# Altium schematic sheet Display7Seg-4511-ULN2003.SCHDOC
size B
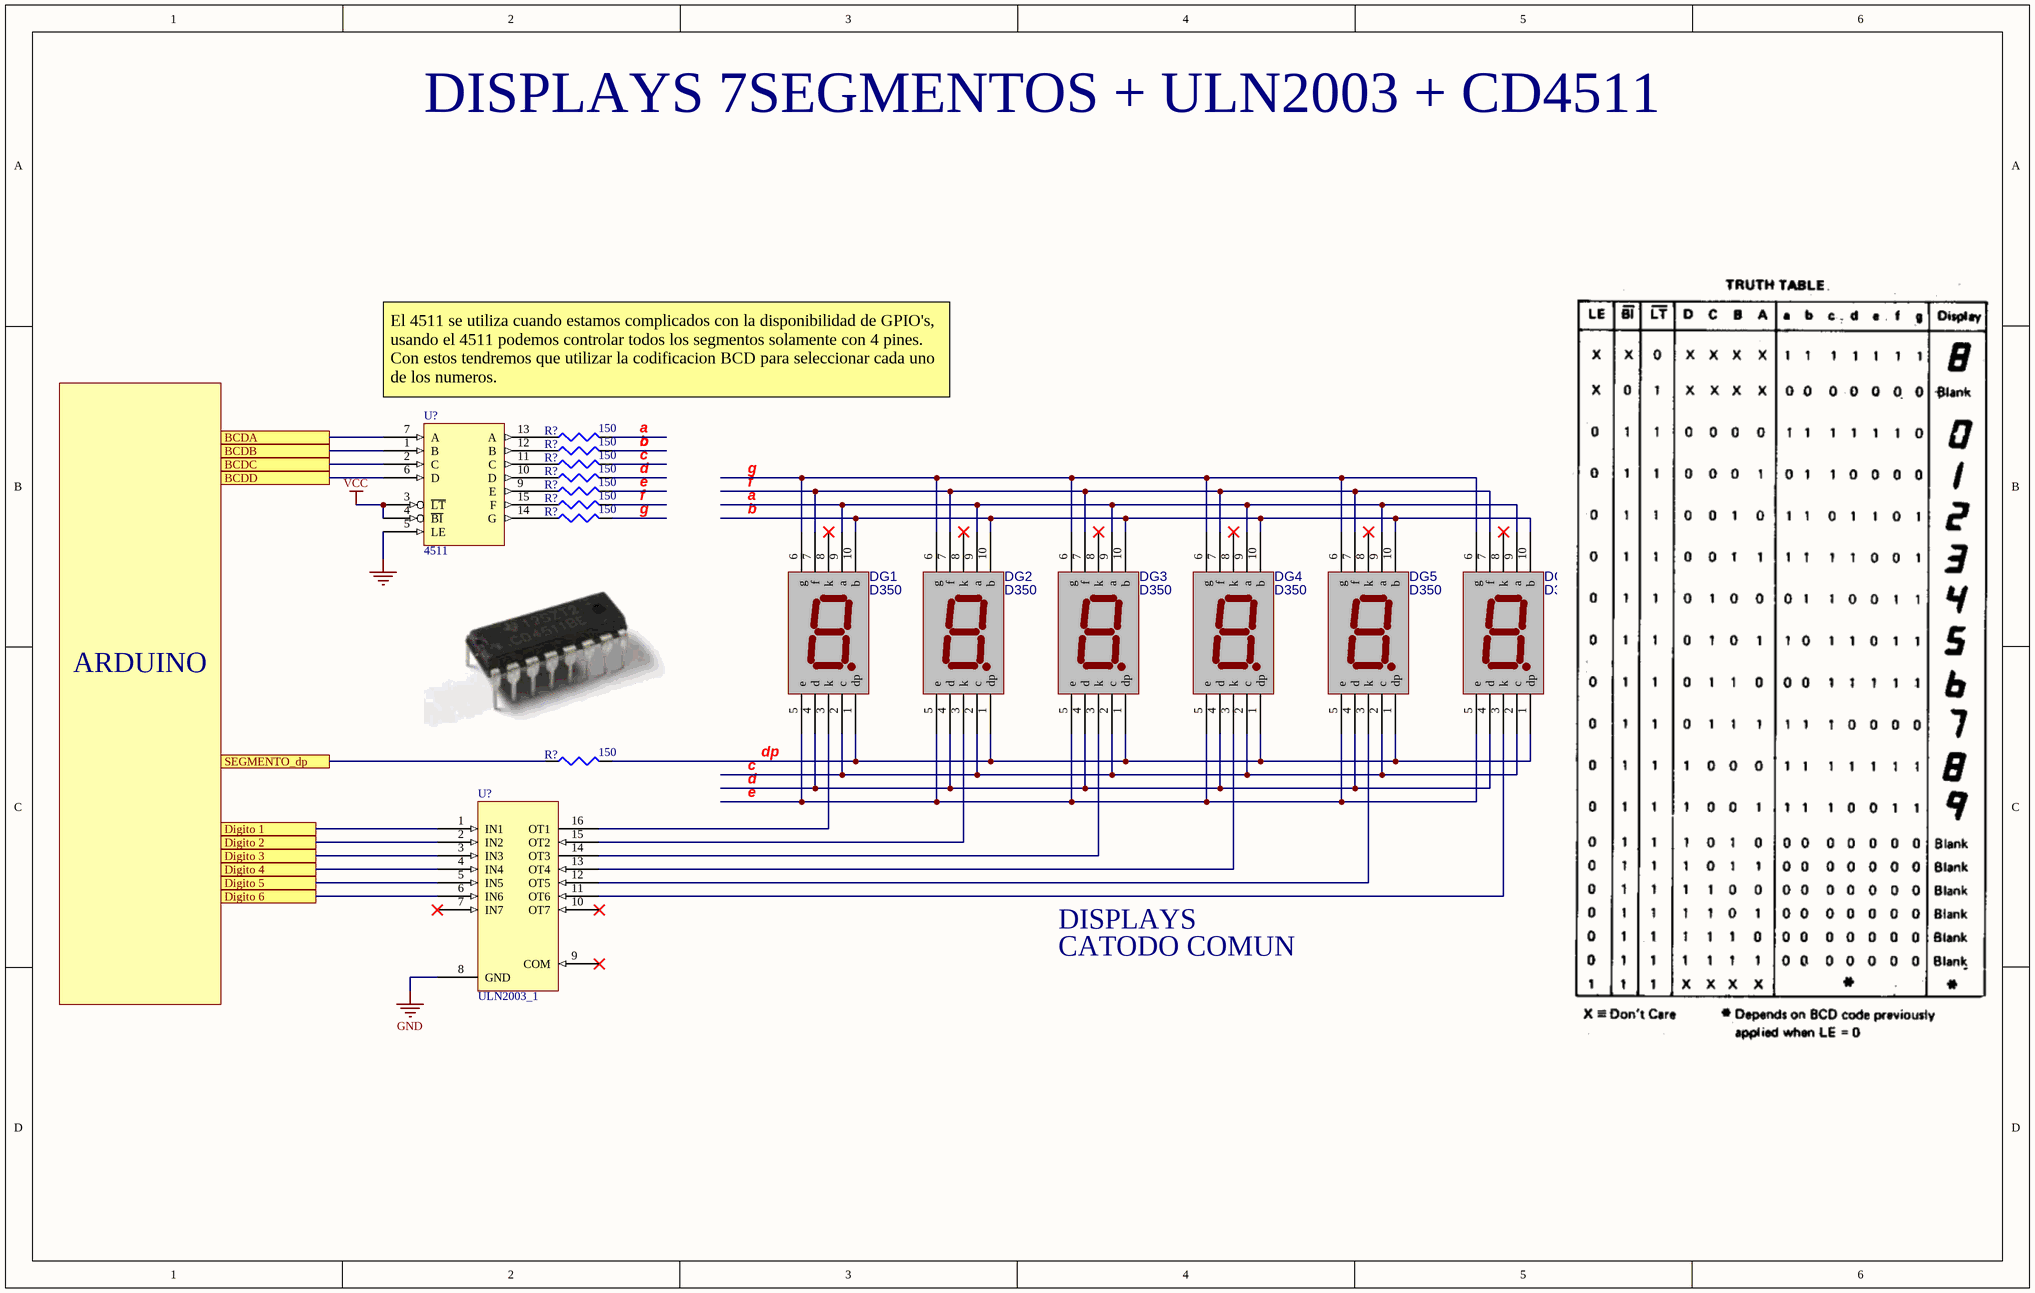
[diagram p0: Display7Seg-4511-ULN2003.SCHDOC]

## Parts
(Parts that share a designator on the sheet are numbered #1, #2 ... from top to bottom, then left to right.)
DG1  D350  [DIGIT0.7]
DG2  D350  [DIGIT0.7]
DG3  D350  [DIGIT0.7]
DG4  D350  [DIGIT0.7]
DG5  D350  [DIGIT0.7]
DG6  D350  [DIGIT0.7]
R?#1  150  [AXIAL0.3]
R?#2  150  [AXIAL0.3]
R?#3  150  [AXIAL0.3]
R?#4  150  [AXIAL0.3]
R?#5  150  [AXIAL0.3]
R?#6  150  [AXIAL0.3]
R?#7  150  [AXIAL0.3]
R?#8  150  [AXIAL0.3]
U?#1  4511  [DIP16]
U?#2  ULN2003_1  [DIP16]

## Ports
BCDA, BCDB, BCDC, BCDD, Digito 1, Digito 2, Digito 3, Digito 4, Digito 5, Digito 6, SEGMENTO_dp

## Nets
GND: U?#1.5(LE) U?#1.8(GND) U?#2.8(GND)
VCC: U?#1.3(~{LT}) U?#1.4(~{BI}) U?#1.16(VCC)
a: DG1.9(a) DG2.9(a) DG3.9(a) DG4.9(a) DG5.9(a) DG6.9(a) R?#1.2
b: DG1.2(c) DG1.10(b) DG2.2(c) DG2.10(b) DG3.2(c) DG3.10(b) DG4.2(c) DG4.10(b) DG5.2(c) DG5.10(b) DG6.2(c) DG6.10(b) R?#2.2 R?#3.2  [also labelled c]
BCDA: U?#1.7(A) ; port BCDA
BCDB: U?#1.1(B) ; port BCDB
BCDC: U?#1.2(C) ; port BCDC
BCDD: U?#1.6(D) ; port BCDD
d: DG1.4(d) DG2.4(d) DG3.4(d) DG4.4(d) DG5.4(d) DG6.4(d) R?#4.2
Digito 1: U?#2.1(IN1) ; port Digito 1
Digito 2: U?#2.2(IN2) ; port Digito 2
Digito 3: U?#2.3(IN3) ; port Digito 3
Digito 4: U?#2.4(IN4) ; port Digito 4
Digito 5: U?#2.5(IN5) ; port Digito 5
Digito 6: U?#2.6(IN6) ; port Digito 6
dp: DG1.1(dp) DG2.1(dp) DG3.1(dp) DG4.1(dp) DG5.1(dp) DG6.1(dp) R?#8.2
e: DG1.5(e) DG2.5(e) DG3.5(e) DG4.5(e) DG5.5(e) DG6.5(e) R?#5.2
f: DG1.7(f) DG2.7(f) DG3.7(f) DG4.7(f) DG5.7(f) DG6.7(f) R?#6.2
g: DG1.6(g) DG2.6(g) DG3.6(g) DG4.6(g) DG5.6(g) DG6.6(g) R?#7.2
SEGMENTO_dp: R?#8.1 ; port SEGMENTO_dp
NetDG1_3: DG1.3(k) U?#2.16(OT1)
NetDG2_3: DG2.3(k) U?#2.15(OT2)
NetDG3_3: DG3.3(k) U?#2.14(OT3)
NetDG4_3: DG4.3(k) U?#2.13(OT4)
NetDG5_3: DG5.3(k) U?#2.12(OT5)
NetDG6_3: DG6.3(k) U?#2.11(OT6)
NetR?#1_1: R?#1.1 U?#1.13(A)
NetR?#2_1: R?#2.1 U?#1.12(B)
NetR?#3_1: R?#3.1 U?#1.11(C)
NetR?#4_1: R?#4.1 U?#1.10(D)
NetR?#5_1: R?#5.1 U?#1.9(E)
NetR?#6_1: R?#6.1 U?#1.15(F)
NetR?#7_1: R?#7.1 U?#1.14(G)

Not connected (* = marked no-connect by the designer): DG1 8(k)*; DG2 8(k)*; DG3 8(k)*; DG4 8(k)*; DG5 8(k)*; DG6 8(k)*; U?#2 7(IN7)* 9(COM)* 10(OT7)*

## Notes on the sheet
- DISPLAYS 7SEGMENTOS + ULN2003 + CD4511
- El 4511 se utiliza cuando estamos complicados con la disponibilidad de GPIO's, usando el 4511 podemos controlar todos los segmentos solamente con 4 pines. Con estos tendremos que utilizar la codificacion BCD para seleccionar cada uno de los numeros.
- ARDUINO
- DISPLAYS
- CATODO COMUN

## Library data of the parts
DG1-DG3 = DGT350: DIGITO DE 1/2 PULGADA; Text Field1: 0,4; 0.54: .54
DG4-DG6 = DGT350: DIGITO DE 1/2 PULGADA; Text Field1: 0,4; 0.54: *
R?#1-R?#8 = RES: Resistor; Text Field1: 0,012
U?#1 = 4511: INTEGRADO; Text Field1: 0,35; Text Field2: BCD / 7 SEG